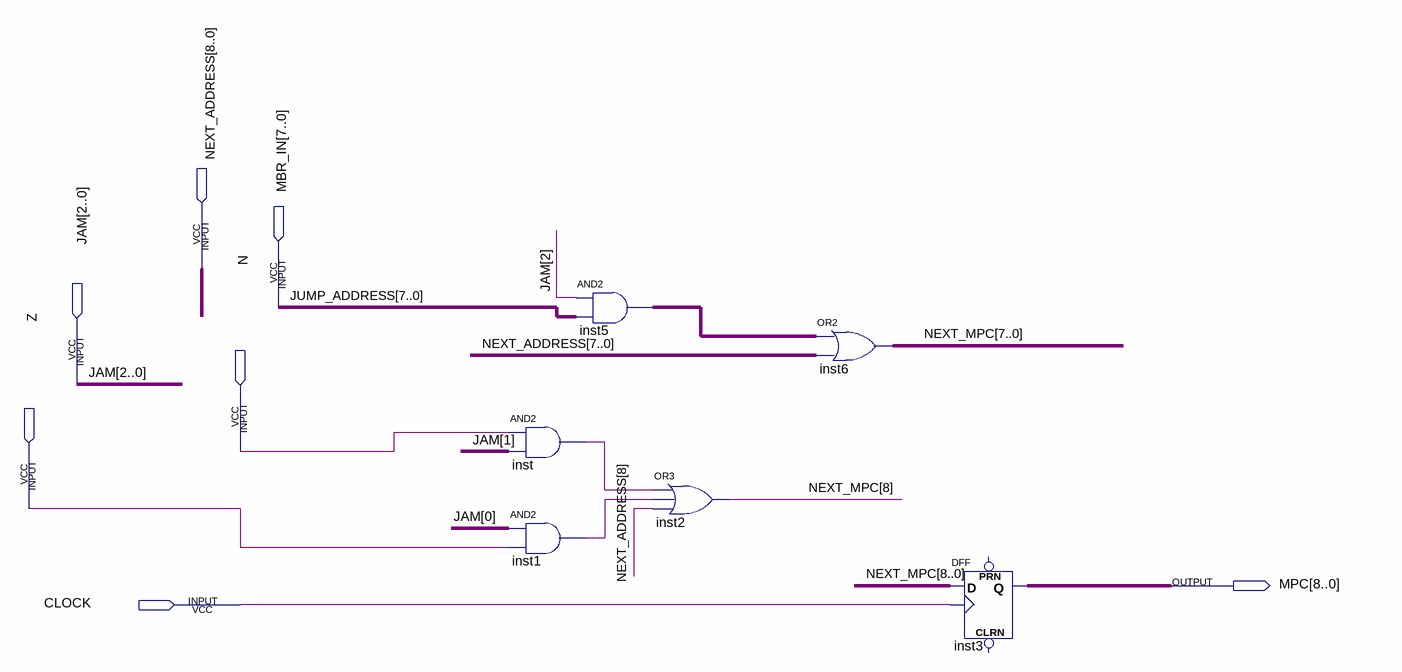
[diagram p0: schematic sheet]
// Quartus schematic MPC.bdf as structural Verilog: 6 symbols, 7 pins
module MPC (
  input  [8:0] NEXT_ADDRESS,
  input  [7:0] MBR_IN,
  input  [2:0] JAM,
  input  N,
  input  Z,
  input  CLOCK,
  output [8:0] MPC
);

  wire inst1_out, inst_out;
  wire [7:0] inst5_out;
  wire [8:0] NEXT_MPC;

  and inst (inst_out, N, JAM[1]);
  and inst1 (inst1_out, JAM[0], Z);
  assign inst5_out = {8{JAM[2]}} & MBR_IN;  // AND2 inst5, 8 bits wide
  or inst2 (NEXT_MPC[8], inst_out, inst1_out, NEXT_ADDRESS[8]);
  assign NEXT_MPC[7:0] = inst5_out | NEXT_ADDRESS[7:0];  // OR2 inst6, 8 bits wide
  DFF inst3[8:0] (.CLK(CLOCK), .D(NEXT_MPC), .Q(MPC));  // open: CLRN, PRN

  // Other names for the same wires on the sheet: JUMP_ADDRESS[7:0] = MBR_IN
endmodule
